# Altium schematic sheet Project_Information.SchDoc: =project_title
size Tabloid; CompanyName: Luxonis Holding; Organization: Luxonis Holding; Address1: 1925 Harmony Park Drive; Address2: Westminster, CO; Address3: 80234; Address4: United States; SheetNumber: 1; SheetTotal: 9
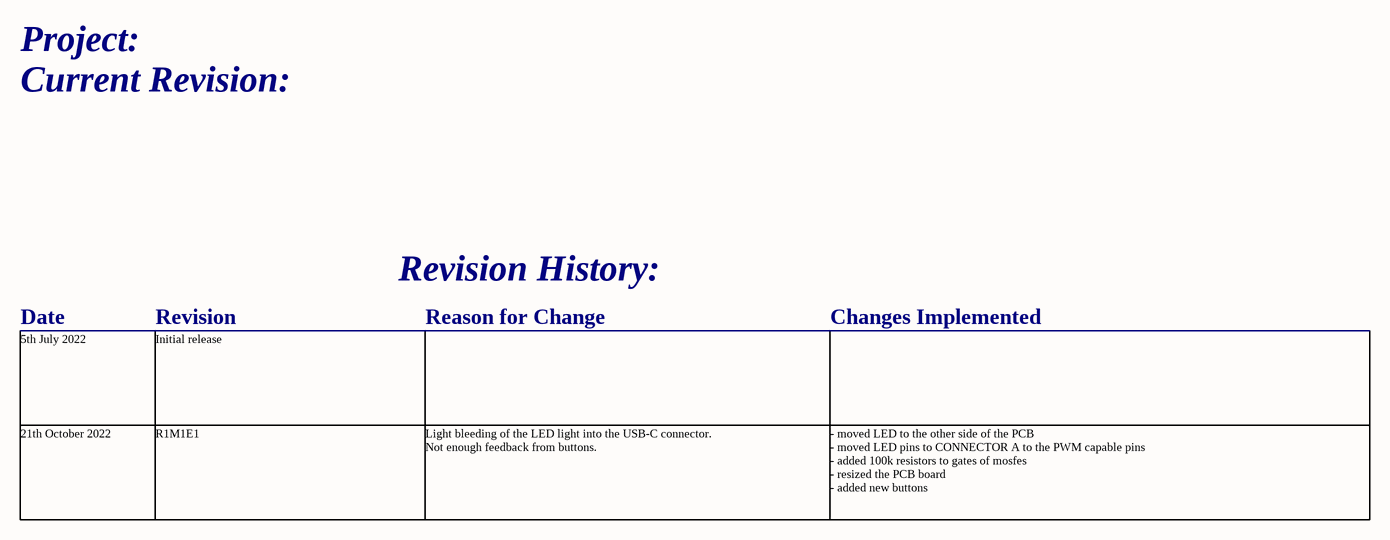
[diagram p0: Project_Information.SchDoc]

## Notes on the sheet
- Project:
- Current Revision:
- Revision History:
- Date
- Revision
- Reason for Change
- Changes Implemented
- 5th July 2022
- Initial release
- 21th October 2022
- R1M1E1
- Light bleeding of the LED light into the USB-C connector.
  Not enough feedback from buttons.
- - moved LED to the other side of the PCB
  - moved LED pins to CONNECTOR A to the PWM capable pins
  - added 100k resistors to gates of mosfes
  - resized the PCB board
  - added new buttons
- Title
- Size:
- Date:
- Tabloid
- Number:
- Time:
- Revision:
- Sheet
- of
- Drawn by: